# EAGLE schematic MySens-easyESP32-003 (EAGLE 7.6.0)
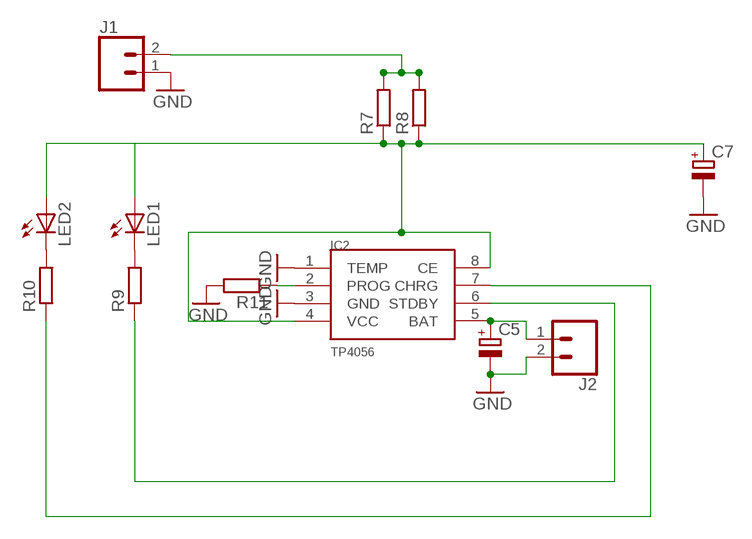
[diagram p0: schematic, sheet 1, part 1 of 2]
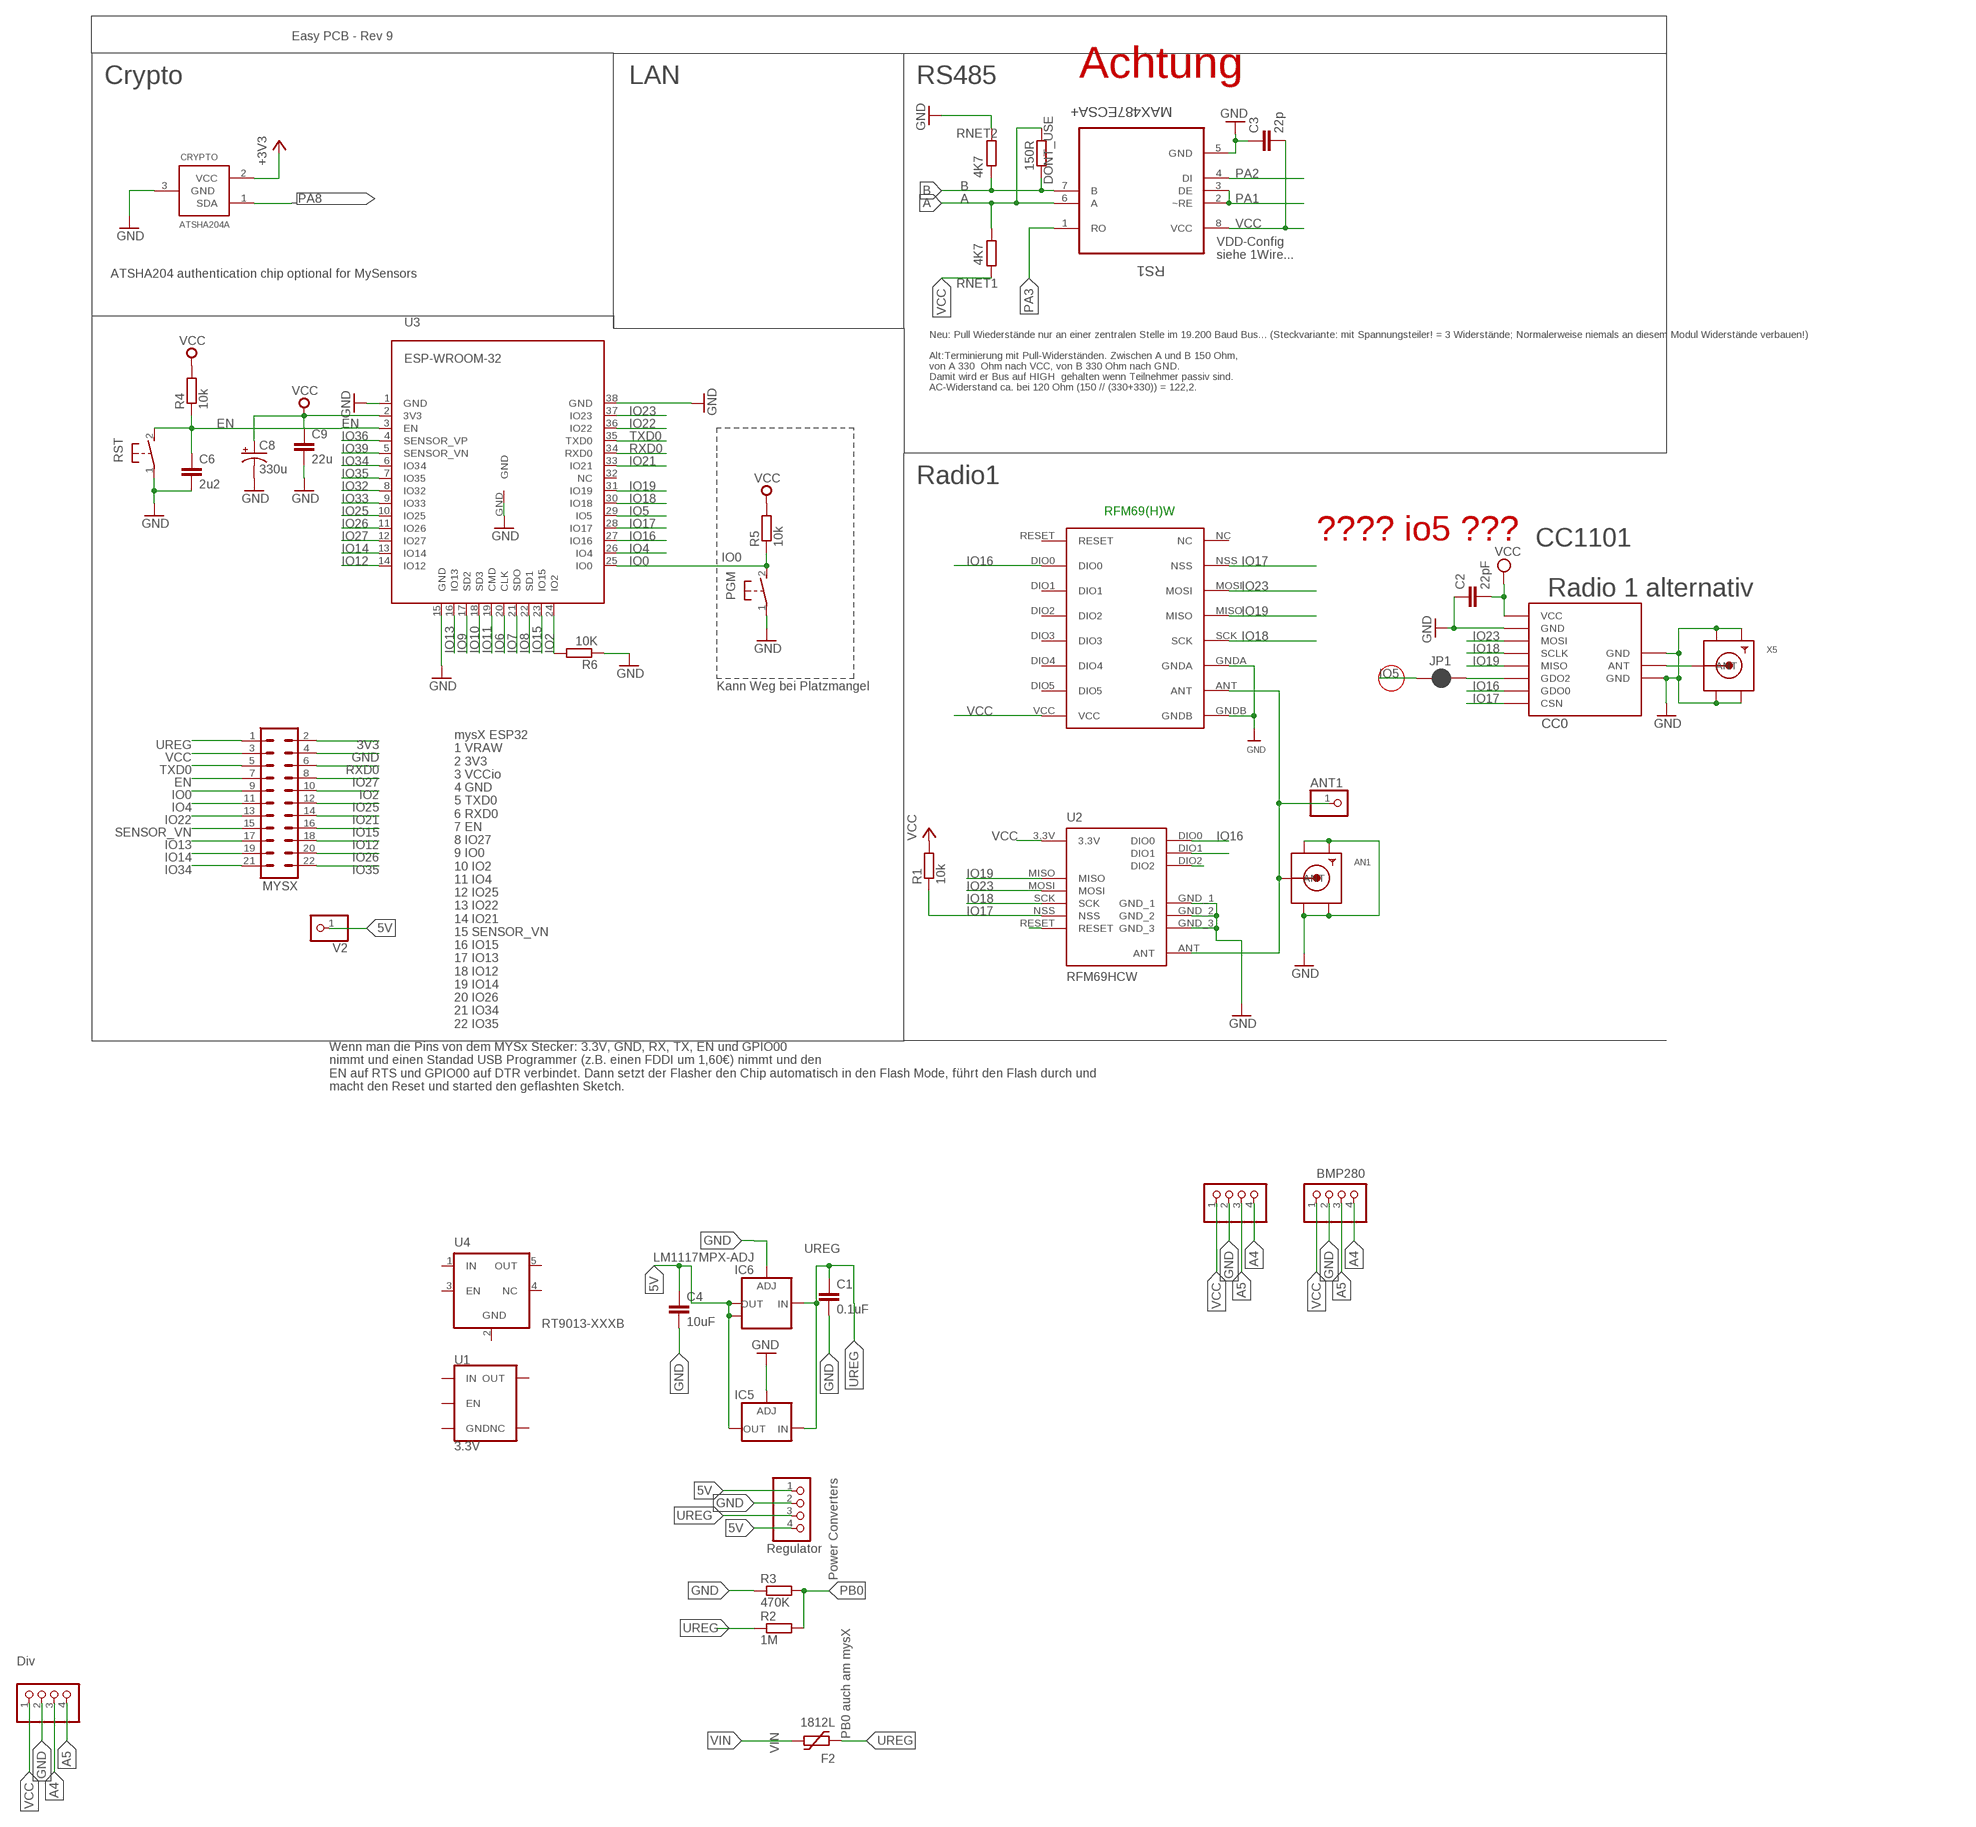
[diagram p1: schematic, sheet 1, part 2 of 2]

## Parts
AN1  SMACONNECTOR_EDGE  [SMA_EDGELAUNCH]
ANT1  PINHD-1X1  [1X01]
BH1750  PINHD-1X04_2.54-S  [1X04-S]
C1  0.1uF  C-EUC1206  [C1206]
C2  22pF  C-EUC0805  [C0805]
C3  22p  C-EUC0805  [C0805]
C4  10uF  C-EUC1210  [C1210]
C5  CPOL-EUE2.5-7  [E2,5-7]
C6  2u2  C-EUC0603  [C0603]
C7  CPOL-EUE2.5-7  [E2,5-7]
C8  330u  CAP_POLSMD  [VISHAY_C]
C9  22u  CAP0805  [0805]
CC0  CC1101  CC1101_MODULE1SMD  [CC1101_MODULE1_SMD]
CRYPTO  ATSHA204A  [SOT23]
DONT_USE  150R  R-EU_R0805  [R0805]
F2  1812L  [1812L]
I2C-1  PINHD-1X04_2.54-S  [1X04-S]
I2C-2  PINHD-1X04_2.54-S  [1X04-S]
IC2  TP4056  [SOP-8]
IC5  LD117ADT50TR  [DPACK]
IC6  LM1117MPX-ADJ  [SOT223]
J1  CONN_02PTH4  [1X02_XTRA_BIG]
J2  CONN_02PTH4  [1X02_XTRA_BIG]
JP1  JUMPER-SMT_2_NC_PASTE_NO-SILK  [SMT-JUMPER_2_NC_PASTE_NO-SILK]
LED1  LED5MM  [LED5MM]
LED2  LED5MM  [LED5MM]
MYSX  MA11-2  [MA11-2]
PGM  DTSM-3  [DTSM-3]
R1  10k  R-EU_M0805  [M0805]
R2  1M  R-EU_R0805  [R0805]
R3  470K  R-EU_R0805  [R0805]
R4  10k  R-EU_R0603  [R0603]
R5  10k  R-EU_R0603  [R0603]
R6  10K  R-EU_R0603  [R0603]
R7  R-EU_R1206  [R1206]
R8  R-EU_R1206  [R1206]
R9  R-EU_R1206  [R1206]
R10  R-EU_R1206  [R1206]
R11  R-EU_R1206  [R1206]
RFM69W1  RFM69HW  [RFM]
RNET1  4K7  R-EU_R0805  [R0805]
RNET2  4K7  R-EU_R0805  [R0805]
RS1  MAX487ECSA+  [SOIC127P600X175-8N]
RST  DTSM-3  [DTSM-3]
STEPDWN  PINHD-1X04_2.54-S  [1X04-S]
U1  3.3V  V_REG_AP2112K-3.3V  [SOT23-5]
U2  RFM69HCW  [RFM69HCW-XXXS2]
U3  ESP-WROOM-32  [ESP-WROOM-32]
U4  RT9013-XXXB  [SOT23-5]
V2  PINHD-1X1  [1X01]
X5  SMACONNECTOR_EDGE  [SMA_EDGELAUNCH]

## Nets
3V3: CRYPTO.2(VCC) MYSX.2 ; supply symbol labelled +3V3
5V: C4.1 IC5.4(OUT) IC6.2(OUT) IC6.TAB(OUT1) STEPDWN.1 STEPDWN.4 V2.1
A: DONT_USE.1 RNET1.2 RS1.6(A)
A4: BH1750.4 I2C-1.4 I2C-2.3
A5: BH1750.3 I2C-1.3 I2C-2.4
ANT0: CC0.ANT X5.P(ANT)
ANT1: AN1.P(ANT) ANT1.1 RFM69W1.ANT U2.ANT
B: DONT_USE.2 RNET2.1 RS1.7(B)
EN: C6.1 MYSX.7 R4.1 RST.2 U3.3(EN)
GND [gnd]: AN1.GND@1(GND4) AN1.GND@2(GND3) AN1.GND@3(GND2) AN1.GND@4(GND1) BH1750.2 C1.2 C2.1 C3.1 C4.2 C5.- C6.2 C7.- C8.- C9.2 CC0.GND@0(GND) CC0.GND@1(GND) CC0.GND@2(GND) CRYPTO.3(GND) I2C-1.2 I2C-2.2 IC2.1(TEMP) IC2.3(GND) IC5.1(ADJ) IC6.1(ADJ) J1.1 J2.2 MYSX.4 PGM.1 R3.1 R6.1 R11.2 RFM69W1.GNDA RFM69W1.GNDB RNET2.2 RS1.5(GND) RST.1 STEPDWN.2 U2.GND_1 U2.GND_2 U2.GND_3 U3.1(GND) U3.15(GND) U3.38(GND) U3.GND X5.GND@1(GND4) X5.GND@2(GND3) X5.GND@3(GND2) X5.GND@4(GND1)
IO0: MYSX.9 PGM.2 R5.1 U3.25(IO0)
IO2: MYSX.10 R6.2 U3.24(IO2)
IO4: MYSX.11 U3.26(IO4)
IO5: JP1.1 U3.29(IO5)
IO6: U3.20(CLK)
IO7: U3.21(SDO)
IO8: U3.22(SD1)
IO9: U3.17(SD2)
IO10: U3.18(SD3)
IO11: U3.19(CMD)
IO12: MYSX.18 U3.14(IO12)
IO13: MYSX.17 U3.16(IO13)
IO14: MYSX.19 U3.13(IO14)
IO15: MYSX.16 U3.23(IO15)
IO16: CC0.GDO0 RFM69W1.DIO0 U2.DIO0 U3.27(IO16)
IO17: CC0.CSN R1.1 RFM69W1.NSS U2.NSS U3.28(IO17)
IO18: CC0.SCLK RFM69W1.SCK U2.SCK U3.30(IO18)
IO19: CC0.MISO RFM69W1.MISO U2.MISO U3.31(IO19)
IO21: MYSX.14 U3.33(IO21)
IO22: MYSX.13 U3.36(IO22)
IO23: CC0.MOSI RFM69W1.MOSI U2.MOSI U3.37(IO23)
IO25: MYSX.12 U3.10(IO25)
IO26: MYSX.20 U3.11(IO26)
IO27: MYSX.8 U3.12(IO27)
IO32: U3.8(IO32)
IO33: U3.9(IO33)
IO34: MYSX.21 U3.6(IO34)
IO35: MYSX.22 U3.7(IO35)
IO36: U3.4(SENSOR_VP)
IO39: U3.5(SENSOR_VN)
MAYBE_IO5: CC0.GDO2 JP1.2
N$1: LED2.K(C) R10.2
N$2: LED1.K(C) R9.2
N$3: C5.+ IC2.5(BAT) J2.1
N$4: U2.DIO2
N$5: J1.2 R7.2 R8.2
N$6: C7.+ IC2.4(VCC) IC2.8(CE) LED1.A LED2.A R7.1 R8.1
N$7: IC2.6(STDBY) R9.1
N$8: U2.DIO1
N$9: U2.RESET
N$10: IC2.7(CHRG) R10.1
N$11: IC2.2(PROG) R11.1
PA1: RS1.2(~RE) RS1.3(DE)
PA2: RS1.4(DI)
PA3: RS1.1(RO)
PA8: CRYPTO.1(SDA)
PB0: R2.2 R3.2
RXD0: MYSX.6 U3.34(RXD0)
SENSOR_VN: MYSX.15
TXD0: MYSX.5 U3.35(TXD0)
UREG [gnd]: C1.1 F2.P$1 IC5.3(IN) IC6.3(IN) MYSX.1 R2.1 STEPDWN.3
VCC [gnd]: BH1750.1 C2.2 C3.2 C8.+ C9.1 CC0.VCC I2C-1.1 I2C-2.1 MYSX.3 R1.2 R4.2 R5.2 RFM69W1.VCC RNET1.1 RS1.8(VCC) U2.3.3V U3.2(3V3)
VIN [gnd]: F2.P$2
Unconnected: RFM69W1.DIO1 RFM69W1.DIO2 RFM69W1.DIO3 RFM69W1.DIO4 RFM69W1.DIO5 RFM69W1.NC RFM69W1.RESET U1.1(IN) U1.2(GND) U1.3(EN) U1.4(NC) U1.5(OUT) U3.32(NC) U4.1(IN) U4.3(EN) U4.4(NC) U4.5(OUT)

## Notes on the sheet
- Easy PCB - Rev 9
- Crypto | LAN | RS485 | Achtung
- VDD-Config
  siehe 1Wire...
- ATSHA204 authentication chip optional for MySensors
- Neu: Pull Wiederstände nur an einer zentralen Stelle im 19.200 Baud Bus... (Steckvariante: mit Spannungsteiler! = 3 Widerstände; Normalerweise niemals an diesem Modul Widerstände verbauen!)
  
  Alt:Terminierung mit Pull-Widerständen. Zwischen A und B 150 Ohm,
  von A 330  Ohm nach VCC, von B 330 Ohm nach GND. 
  Damit wird er Bus auf HIGH  gehalten wenn Teilnehmer passiv sind.
  AC-Widerstand ca. bei 120 Ohm (150 // (330+330)) = 122,2.
- Radio1
- RFM69(H)W
- ???? io5 ??? | CC1101
- Radio 1 alternativ
- Kann Weg bei Platzmangel
- mysX ESP32
  1 VRAW
  2 3V3
  3 VCCio
  4 GND
  5 TXD0
  6 RXD0
  7 EN
  8 IO27
  9 IO0
  10 IO2
  11 IO4
  12 IO25
  13 IO22
  14 IO21
  15 SENSOR_VN
  16 IO15
  17 IO13
  18 IO12
  19 IO14
  20 IO26
  21 IO34
  22 IO35
- Wenn man die Pins von dem MYSx Stecker: 3.3V, GND, RX, TX, EN und GPIO00
  nimmt und einen Standad USB Programmer (z.B. einen FDDI um 1,60€) nimmt und den
  EN auf RTS und GPIO00 auf DTR verbindet. Dann setzt der Flasher den Chip automatisch in den Flash Mode, führt den Flash durch und
  macht den Reset und started den geflashten Sketch.
- BMP280
- Power Converters
- Regulator
- PB0 auch am mysX
- Div

## Power pins joined to a net without a drawn wire
GND: U4.2(GND)

## Library data of the parts
AN1 X5 = adafruit:SMACONNECTOR: SMA Connector 90° DIP SMA Connector, 50 Ohm (4UConnector: 07259)
ANT1 V2 = pinhead:PINHD-1X1: PIN HEADER
BH1750 I2C-1 I2C-2 STEPDWN = pinhead-2:PINHD-1X04: PIN HEADER
C1-C4 C6 = rcl:C-EU: CAPACITOR, European symbol
C5 C7 = rcl:CPOL-EU: POLARIZED CAPACITOR, European symbol; SPICEPREFIX: C
C8 = SparkFun-Passives:CAP_POL: Capacitor Polarized These are standard SMD and PTH capacitors. Normally 10uF, 47uF, and 100uF in electrolytic and tantalum varieties. Always verify the external diameter of the through hole cap, it varies with capacity, voltage, and manufacturer. The EIA devices should be standard.
C9 = SparkFun-Passives:CAP: Capacitor Standard 0603 ceramic capacitor, and 0.1" leaded capacitor.
CC0 = wireless:CC1101_MODULE1: CC1101 wireless module for 433/868 MHz (sold from Aliexpress). DIL version for mounting with pin header (and SMD soldering) and SMD only variant available.
CRYPTO = Sensor:ATSHA204A
DONT_USE R1-R6 RNET1 RNET2 = rcl:R-EU_: RESISTOR, European symbol
F2 = ptc-littlefuse:1812L
IC2 = TP4056:TP4056
IC5 = v-reg:LD117A?*: Low drop fixed and adjustable positive voltage regulators 1 A Source: http://www.st.com/stonline/products/literature/ds/7194/ld1117axx.pdf
IC6 = lm1117:LM1117MPX-ADJ
J1 J2 = SparkFun-Connectors:CONN_02: Multi connection point. Often used as Generic Header-pin footprint for 0.1 inch spaced/style header connections On any of the 0.1 inch spaced packages, you can populate with these: Break Away Headers - Straight <https://www.sparkfun.com/products/116> (PRT-00116) Break Away Male Headers - Right Angle <https://www.sparkfun.com/products/553> (PRT-00553) Female Headers <https://www.sparkfun.com/products/115> (PRT-00115) Break Away Headers - Machine Pin <https://www.sparkfun.com/products/117> (PRT-00117) Break Away Female Headers - Swiss Machine Pin <https://www.sparkfun.com/products/743> (PRT-00743) For SCREWTERMINALS and SPRING TERMINALS visit here: Screw Terimnals on SparkFun.com <https://www.sparkfun.com/search/results?term=Screw+Terminals> (5mm/3.5mm/2.54mm spacing) This device is also useful as a general connection point to wire up your design to another part of your project. Our various solder wires solder well into these plated through hole pads. Hook-Up Wire - Assortment (Stranded, 22 AWG) <https://www.sparkfun.com/products/11375> (PRT-11375) Hook-Up Wire - Assortment (Solid Core, 22 AWG) <https://www.sparkfun.com/products/11367> (PRT-11367) View the entire wire category on our website here <https://www.sparkfun.com/categories/141> Special notes: Molex polarized connector foot print use with: PRT-08233 with associated crimp pins and housings. 2.54_SCREWTERM for use with PRT-10571. 3.5mm Screw Terminal footprints for PRT-08084 5mm Screw Terminal footprints for use with PRT-08432
JP1 = SparkFun-Jumpers:JUMPER-SMT_2_NC_PASTE: Normally closed solder jumper This jumper has an aperture in the stencil to allow solder paste to bridge the split in the wire so it's normally closed (NC). Wick off the solder to open the connection. Reapply solder to reclose the connection.
LED1 LED2 = led:LED: LED OSRAM: - CHIPLED LG R971, LG N971, LY N971, LG Q971, LY Q971, LO R971, LY R971 LH N974, LH R974 LS Q976, LO Q976, LY Q976 LO Q996 - Hyper CHIPLED LW Q18S LB Q993, LB Q99A, LB R99A - SideLED LS A670, LO A670, LY A670, LG A670, LP A670 LB A673, LV A673, LT A673, LW A673 LH A674 LY A675 LS A676, LA A676, LO A676, LY A676, LW A676 LS A679, LY A679, LG A679 - Hyper Micro SIDELED® LS Y876, LA Y876, LO Y876, LY Y876 LT Y87S - SmartLED LW L88C, LW L88S LB L89C, LB L89S, LG L890 LS L89K, LO L89K, LY L89K LS L896, LA L896, LO L896, LY L896 - TOPLED LS T670, LO T670, LY T670, LG T670, LP T670 LSG T670, LSP T670, LSY T670, LOP T670, LYG T670 LG T671, LOG T671, LSG T671 LB T673, LV T673, LT T673, LW T673 LH T674 LS T676, LA T676, LO T676, LY T676, LB T676, LH T676, LSB T676, LW T676 LB T67C, LV T67C, LT T67C, LS T67K, LO T67K, LY T67K, LW E67C LS E67B, LA E67B, LO E67B, LY E67B, LB E67C, LV E67C, LT E67C LW T67C LS T679, LY T679, LG T679 LS T770, LO T770, LY T770, LG T770, LP T770 LB T773, LV T773, LT T773, LW T773 LH T774 LS E675, LA E675, LY E675, LS T675 LS T776, LA T776, LO T776, LY T776, LB T776 LHGB T686 LT T68C, LB T68C - Hyper Mini TOPLED® LB M676 - Mini TOPLED Santana® LG M470 LS M47K, LO M47K, LY M47K Source: http://www.osram.convergy.de LUXEON: - LUMILED® LXK2-PW12-R00, LXK2-PW12-S00, LXK2-PW14-U00, LXK2-PW14-V00 LXK2-PM12-R00, LXK2-PM12-S00, LXK2-PM14-U00 LXK2-PE12-Q00, LXK2-PE12-R00, LXK2-PE12-S00, LXK2-PE14-T00, LXK2-PE14-U00 LXK2-PB12-K00, LXK2-PB12-L00, LXK2-PB12-M00, LXK2-PB14-N00, LXK2-PB14-P00, LXK2-PB14-Q00 LXK2-PR12-L00, LXK2-PR12-M00, LXK2-PR14-Q00, LXK2-PR14-R00 LXK2-PD12-Q00, LXK2-PD12-R00, LXK2-PD12-S00 LXK2-PH12-R00, LXK2-PH12-S00 LXK2-PL12-P00, LXK2-PL12-Q00, LXK2-PL12-R00 Source: www.luxeon.com KINGBRIGHT: KA-3528ASYC Source: www.kingbright.com
MYSX = con-Pinheader:MA11-2: PIN HEADER; OC_FARNELL: unknown; OC_NEWARK: unknown
PGM RST = switch-tact:DTSM-3
R7-R11 = resistor:R-EU_: RESISTOR, European symbol
RFM69W1 = hoperf:RFM69HW
RS1 = Maxim_By_element14_Batch_1:MAX487ECSA+: Low-Power, Slew-Rate-Limited RS-485/RS-422 Transceivers; MPN: MAX487ECSA+; OC_FARNELL: 9724532; OC_NEWARK: 68K4803; PACKAGE: SOIC-8; SUPPLIER: Maxim
U1 = SparkFun-IC-Power:V_REG_AP2112: AP2112 - 600mA CMOS LDO Regulator w/ Enable The AP2112 is CMOS process low dropout linear regulator with enable function, the regulator delivers a guaranteed 600mA (min.) continuous load current. Features Output Voltage Accuracy: ±1.5% Output Current: 600mA (Min.) Foldback Short Current Protection: 50mA Enable Function to Turn ON/OFF VOUT Low Dropout Voltage (3.3V): 250mV (Typ.) @IOUT=600mA Excellent Load Regulation: 0.2%/A (Typ.) Excellent Line Regulation: 0.02%/V (Typ.) Low Quiescent Current: 55μA (Typ.) Low Standby Current: 0.01μA (Typ.) Low Output Noise: 50μVRMS PSRR: 100Hz -65dB, 1kHz -65dB OTSD Protection Stable with 1.0μF Flexible Cap: Ceramic, Tantalum and Aluminum Electrolytic Operation Temperature Range: -40°C to 85°C ESD: MM 400V, HBM 4000V; PROD_ID: VREG-12457
U2 = doug:RFM69H
U3 = esp32:ESP-WROOM-32
U4 = v-reg:RT9013-XXX: LDO REGULATOR 500mA, Low Dropout, Low Noise Ultra-Fast without bypass capacitor CMOS LDO Regulator

## Net classes
0 default: width 0.254 mm, clearance 0.205 mm
1 gnd: width 0.635 mm, drill 0.635 mm, clearance 0.254 mm
2 vcc: width 0.406 mm, drill 0.406 mm, clearance 0.254 mm